# Altium schematic sheet MD070B_CONTROL.SchDoc
size 431 x 279 mm; Date: Not shown in title block; ApprovedBy: Not shown in title block; CheckedBy: Not shown in title block; Author: Not shown in title block; CompanyName: Not shown in title block; Engineer: Not shown in title block; Organization: Not shown in title block; Address1: Not shown in title block; Address2: Not shown in title block; Address3: Not shown in title block; Address4: Not shown in title block; DocumentNumber: 1; Revision: Use project parameter SCH_Rev; SheetNumber: 2; SheetTotal: 5; PageSetup: Record=PageOptions|CenterHorizontal=True|CenterVertical=True|PrintScale=1.00|XCorrection=1.00|YCorrection=1.00|PrintKind=0|BorderSize=5000000|LeftOffset=0|BottomOffset=0|Orientation=2|PaperLength=1000|PaperWidth=1000|Scale=100|PaperSource=15|PrintQuality=600|MediaType=1|DitherType=10|PaperKind=Letter|PrintScaleMode=1; CurrentTime: Not shown in title block; CurrentDate: Not shown in title block; Time: Not shown in title block; DocumentFullPathAndName: Not shown in title block; DocumentName: Not shown in title block; ModifiedDate: Not shown in title block; ImagePath: Not shown in title block
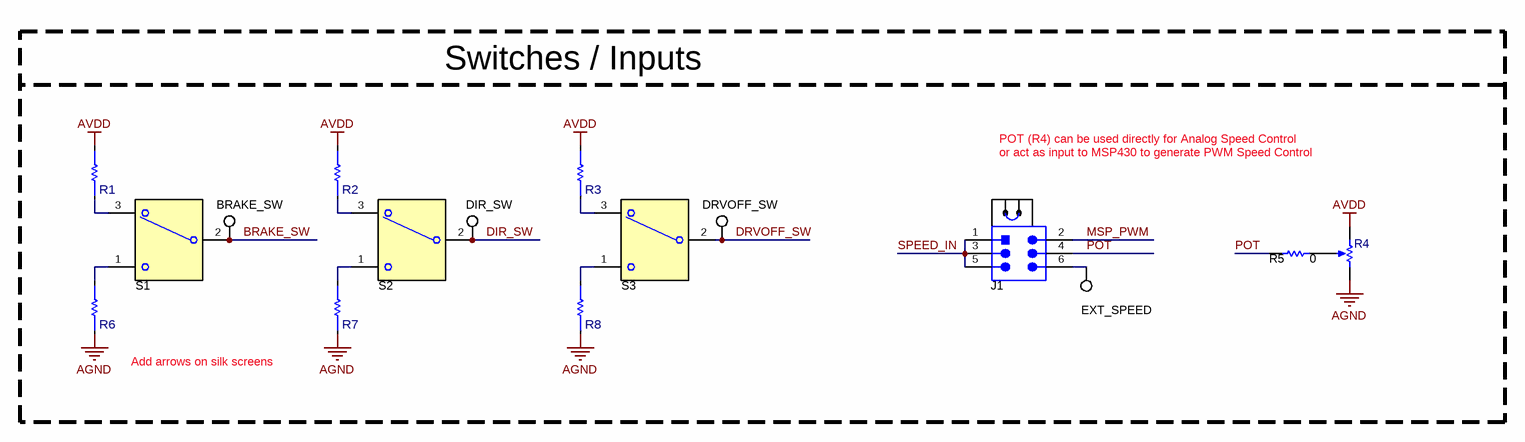
[diagram p0: MD070B_CONTROL.SchDoc]

## Parts
J1  Header_3x2  [TSW-103-07-G-D]  (value not drawn)
R1  ERA-3ARB103V  [FP-ERA-3ARB103V_0603-MFG]  (value not drawn)
R2  ERA-3ARB103V  [FP-ERA-3ARB103V_0603-MFG]  (value not drawn)
R3  ERA-3ARB103V  [FP-ERA-3ARB103V_0603-MFG]  (value not drawn)
R4  3352T-1-253LF  [Bourns_3352T]  (value not drawn)
R5  ValueDisplayed: 0  [0603L]  (hidden comment: ERJ-3GEY0R00V)
R6  ERA-3ARB103V  [FP-ERA-3ARB103V_0603-MFG]  (value not drawn)
R7  ERA-3ARB103V  [FP-ERA-3ARB103V_0603-MFG]  (value not drawn)
R8  ERA-3ARB103V  [FP-ERA-3ARB103V_0603-MFG]  (value not drawn)
S1  SW_SPDT_COM2_1_3  [SW_B12AP]  (value not drawn)
S2  SW_SPDT_COM2_1_3  [SW_B12AP]  (value not drawn)
S3  SW_SPDT_COM2_1_3  [SW_B12AP]  (value not drawn)
SH-J1  SNT-100-BK-G  [SNT-100-BK-G]  (value not drawn)
TP1  EXT_SPEED  [Keystone5002]
TP2  BRAKE_SW  [Keystone5002]
TP3  DIR_SW  [Keystone5002]
TP4  DRVOFF_SW  [Keystone5002]

## Nets
AGND: R4.3(CW) R6.1 R7.1 R8.1
AVDD: R1.2 R2.2 R3.2 R4.1(CCW)
BRAKE_SW: S1.2(COM) TP2.1
DIR_SW: S2.2(COM) TP3.1
DRVOFF_SW: S3.2(COM) TP4.1
MSP_PWM: J1.2
POT: J1.4 R5.1
SPEED_IN: J1.1 J1.3 J1.5
NetJ1_6: J1.6 TP1.1
NetR1_1: R1.1 S1.3
NetR2_1: R2.1 S2.3
NetR3_1: R3.1 S3.3
NetR4_2: R4.2(WIPER) R5.2
NetR6_2: R6.2 S1.1
NetR7_2: R7.2 S2.1
NetR8_2: R8.2 S3.1

## Notes on the sheet
- Switches / Inputs
- POT (R4) can be used directly for Analog Speed Control
- or act as input to MSP430 to generate PWM Speed Control
- Add arrows on silk screens
- Drawn By:
- SVN Rev:
- Number:
- TID #:
- Orderable:
- Rev:
- Sheet Title:
- File:
- Project Title:
- Designed for:
- Assembly Variant:
- Mod. Date:
- Sheet:
- Size:
- of
- B
- http://www.ti.com
- Texas Instruments and/or its licensors do not warrant the accuracy or completeness of this specification or any information contained therein. Texas Instruments and/or its licensors do not warrant that this design will meet the specifications, will be suitable for your application or fit for any particular purpose, or will operate in an implementation. Texas Instruments and/or its licensors do not warrant that the design is production worthy. You should completely validate and test your design implementation to confirm the system functionality for your application.
- Engineer:
- Contact:
- © Texas Instruments

## Library data of the parts
J1 = CMP-0075406-2: Header, 100mil, 3x2, Gold, TH; Manufacturer: Samtec; Pitch_mm: 2.54; Gender: Male; Shrouded: N; Row_Count: 2; Current_A: 6.3A; Voltage_V: 550V; Cert_CSA: Y; Green_Lifecycle: Active; Green_REACh: Passed; PartNumber: TSW-103-07-G-D; PackageReference: 3x2 Header; ClassName: Header; CompType: Header; RoHS: Y; MountType: TH; ComponentLink1Description: Datasheet URL; ComponentLink1URL: http://samtec.com/ftppub/pdf/TSW_TH.PDF; Orientation: Vertical; PinCount: 6; RowSpacing_mm: 2.54; ContactFinish: Gold; Color: Black; Cert_UL: Y; Cert_CULUS: N; Cert_VDE: N; Supplier 1: Digi-Key; Supplier Part Number 1: SAM1028-03-ND; Green_EU RoHS: Passed; Green_EU RoHS-2: Passed
R1-R3 R6-R8 = CMP-0092019-1: Res Thin Film 0603 10K Ohm 0.1% 1/10W ±10ppm/°C Molded SMD SMD Punched Carrier T/R; Manufacturer: Panasonic; AEC Grade: Grade 0; Power_W: 100mW; VDC_V: 75V; SizeZ_mm: 0.55mm; AEC Qualified: Yes; Res_ohm: 10k; Supplier 2: Mouser; ComponentLink1URL: https://industrial.panasonic.com/cdbs/www-data/pdf/RDM0000/AOA0000C307.pdf; Supplier Part Number 1: P10KBDCT-ND; RoHS: TRUE; Value: 10k; PartNumber: ERA-3ARB103V; PackageReference: 0603; Supplier 1: Digikey; ComponentLink1Description: Datasheet; Tolerance_%: 0.1%; Supplier Part Number 2: 667-ERA-3ARB103V; TempCo: 10ppm/°C; Technology: Thin Film; Mouser Description: Res Thin Film 0603 10K Ohm 0.1% 1/10W ±10ppm/°C Molded SMD SMD Punched Carrier T/R; Digikey Part Number: P10KBDCT-ND; Operating Temperature Range: -55°C to +155°C; Mouser Part Number: 667-ERA-3ARB103V; Part Number: ERA-3ARB103V; Series: ERA; Lead Free: Yes; Digikey Description: RES SMD 10K OHM 0.1% 1/10W 0603; helpURL: https://upverter.com/upn/revision/497126050f1df72a/; datasheet: https://industrial.panasonic.com/cdbs/www-data/pdf/RDM0000/AOA0000C307.pdf; Datasheet Path: datasheets/Res-ERA-3ARB103V.pdf
R4 = CMP-0001776-2: Trimmer Potentiometer, 25kohm, 0.5W, TH; Manufacturer: Bourns; Value: 25 kohm; Publisher: Texas Instruments; MountType: TH; ComponentLink1Description: Datasheet URL; Supplier 2: Newark; Supplier 3: Mouser; Supplier 1: Digi-Key; Supplier Part Number 1: 3352T-253LF-ND; Supplier Part Number 2: 32K8170; Supplier Part Number 3: 652-3352T-1-253LF; LatestRevisionDate: 09/03/2017; PartNumber: 3352T-1-253LF; PackageReference: 9.53x8.89mm; CompType: Trimmer; RoHS: Y; ComponentLink1URL: http://www.bourns.com/data/global/PDFs/3352.pdf
R5 = CMP-0025874-4: RES, 0, 5%, 0.1 W, AEC-Q200 Grade 0, 0603; Manufacturer: Panasonic; Power_W: 100mW; TempCo: 600 ppm/C; Value_Code: 0000; Value: 0; EIA_Code: E24; SizeX_mm: 1.6; SizeY_mm: 0.8; SizeZ_mm: 1; Value2: 0.1W; SizeArea_mm2: 1.28; AEC Qualified: Y; VDC_V: 50V; AEC Category: Q200; SizeAreaWB_mm2: 4.68; Supplier Part Number 2: 667-ERJ-3GEY0R00V; Supplier 2: Mouser; Supplier Part Number 3: 2059527; Supplier 3: Farnell; RoHS: Y; Value1: 5%; MountType: SMT; Supplier 1: Digi-Key; PackageReference: 0603; Tolerance_%: 5%; Res_ohm: 0; CompType: Resistor; PartNumber: ERJ-3GEY0R00V; ComponentLink1Description: Datasheet link; Supplier Part Number 1: P0.0GCT-ND; Technology: Thick Film; ComponentLink1URL: https://industrial.panasonic.com/cdbs/www-data/pdf/RDA0000/AOA0000C301.pdf; AEC Grade: 0
S1-S3 = CMP-0002155-2: SWITCH TOGGLE SPDT 0.4VA 28V; PartNumber: B12AP; Manufacturer: NKK Switches; SwitchFunction: On-On; PositionCount: 2; CurrentRating_mA: 100A; MountType: TH; ComponentLink1Description: Datasheet URL; ComponentLink1URL: http://www.nkkswitches.com/pdf/Btoggles.pdf; RoHS: Y; Circuit: SPDT; VDC_V: 28V; Orientation: Top Actuated; CompType: Switch; PackageReference: 6.8x23.1x8.8mm; Publisher: Texas Instruments; LatestRevisionDate: 2017-03-09; Supplier 1: Digi-Key; Supplier Part Number 1: 360-1012-ND; Supplier 2: Newark; Supplier Part Number 2: 09X8543; Supplier 3: Mouser; Supplier Part Number 3: 633-B12AP
SH-J1 = CMP-0003623-3: Shunt, 100mil, Gold plated, Black; Alternate PartNumber: 969102-0000-DA; Manufacturer: Samtec; Alternate Manufacturer: 3M; Value: 1x2; ComponentLink1URL: http://www.samtec.com/ftppub/pdf/SNT.PDF; Supplier 1: Digi-Key; CompType: Shunt; PackageReference: Shunt; ClassName: Shunt; RoHS: Y; Supplier Part Number 1: SAM8858-ND; MountType: N/A; PartNumber: SNT-100-BK-G; ComponentLink1Description: Datasheet Link
TP1-TP4 = CMP-0055139-1: Test Point, Miniature, White, TH; Manufacturer: Keystone; CNHeader: FALSE; Green_Lifecycle: Active; Green_REACh: Passed; ContactFinish: Silver; CT: TRUE; ComponentLink1URL: http://www.keyelco.com/userAssets/file/M60-2p60.pdf; Supplier Part Number 2: 82H9632; Publisher: Texas Instruments; Supplier 2: Newark; Supplier Part Number 3: 534-5002; Color: White; Supplier 3: Mouser; RoHS: Y; MountType: TH; Green_EU RoHS-2: Passed; Supplier 1: Digi-Key; Green_EU RoHS: Passed; PackageReference: White Miniature Testpoint; CompType: Test Point; LatestRevisionDate: 26/05/2017; PartNumber: 5002; ComponentLink1Description: Datasheet URL; Supplier Part Number 1: 36-5002-ND